# Altium schematic sheet 0063_DG2 DISPLAY - HDMI.SchDoc
size 848 x 558 mm
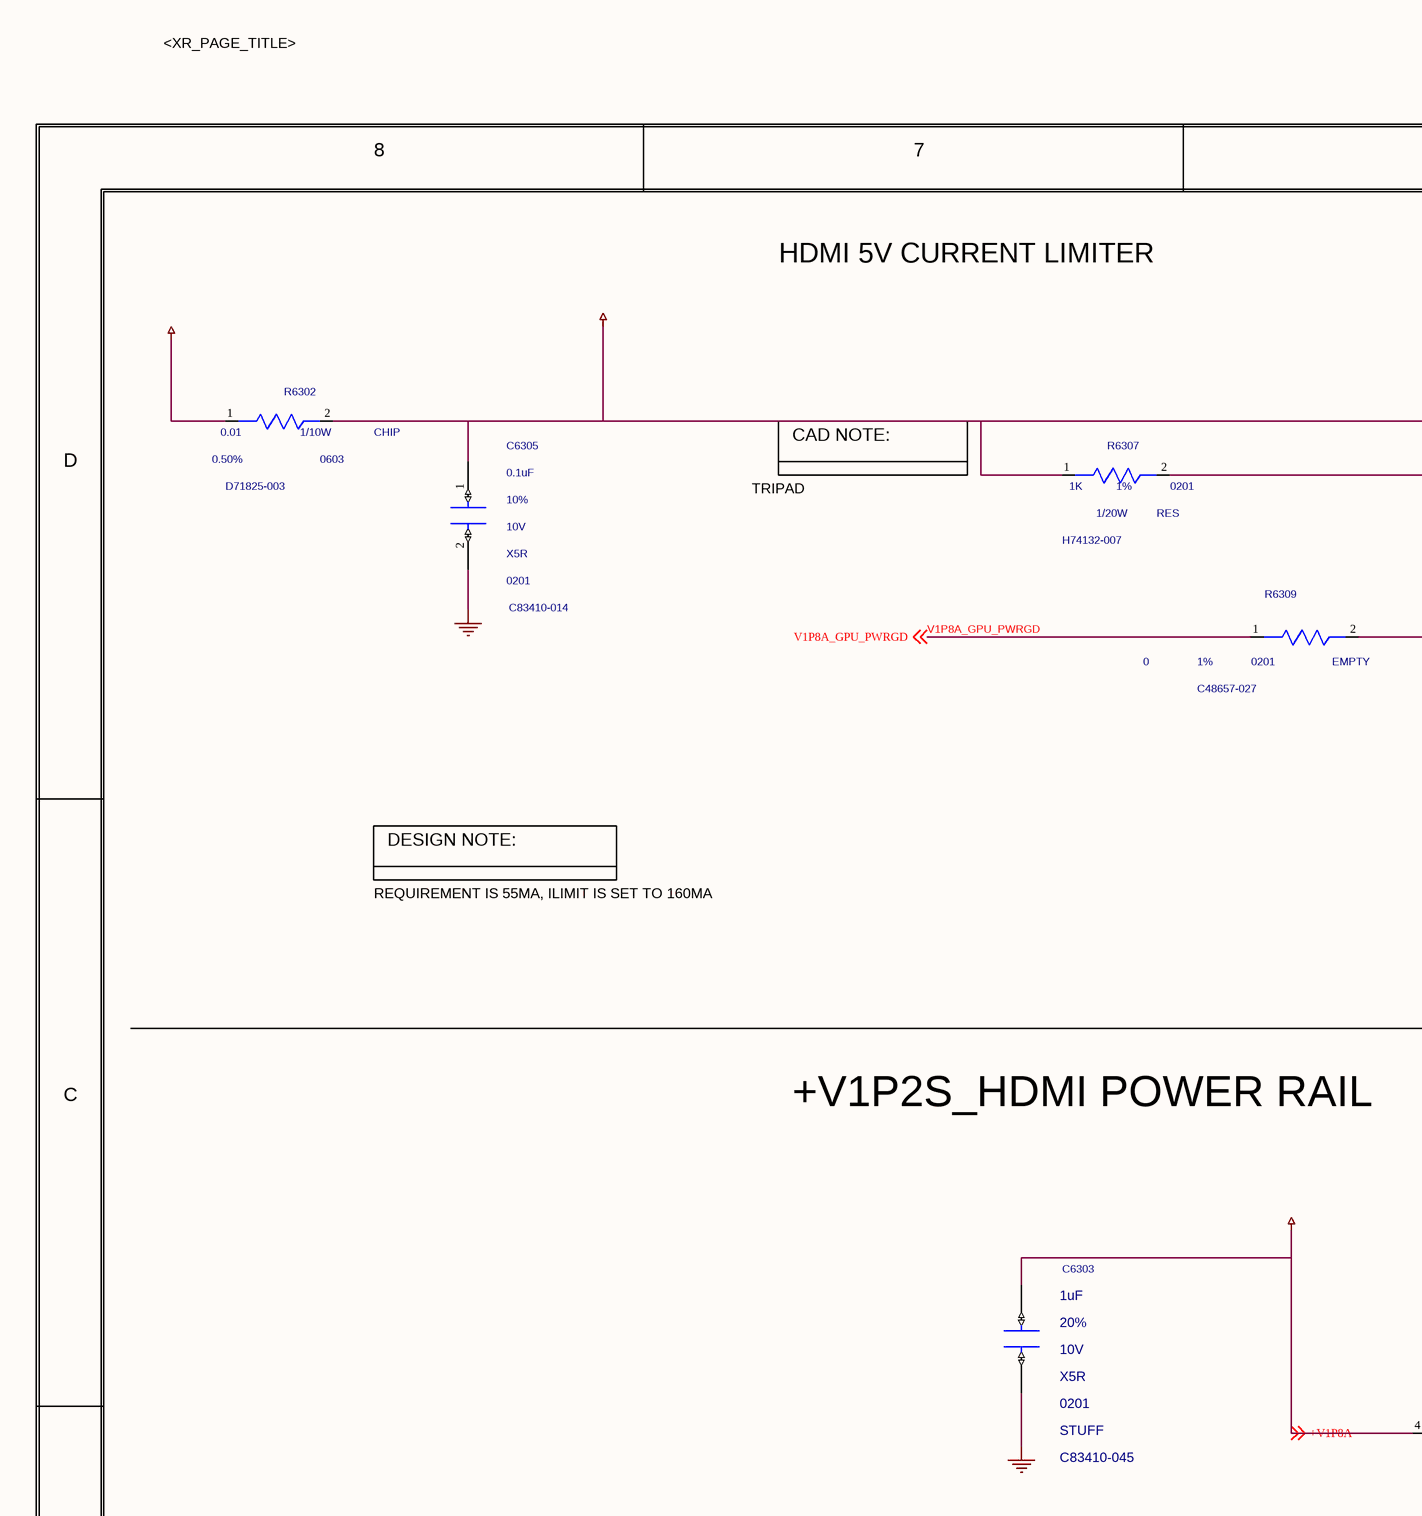
[diagram p0: 0063_DG2 DISPLAY - HDMI.SchDoc, top left]
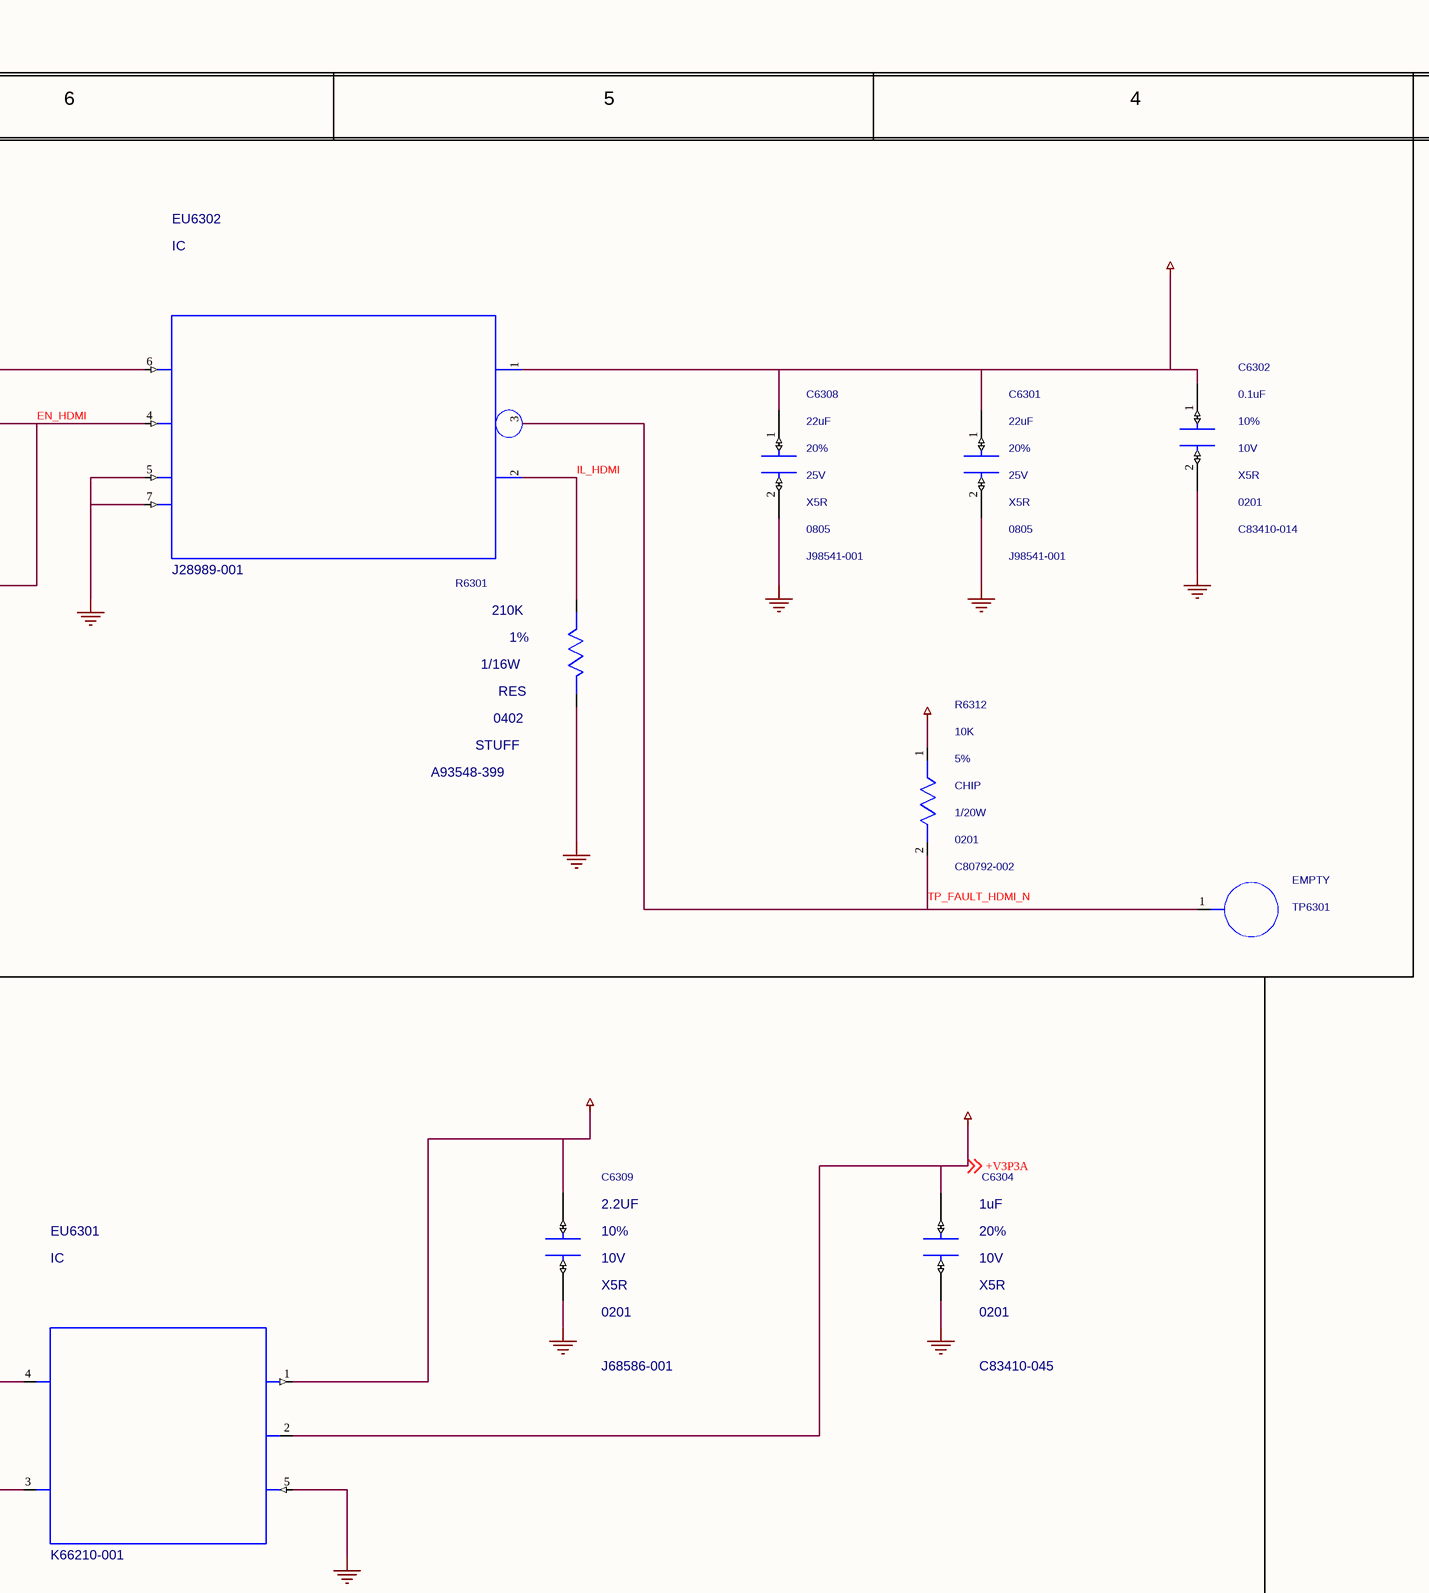
[diagram p1: 0063_DG2 DISPLAY - HDMI.SchDoc, top middle]
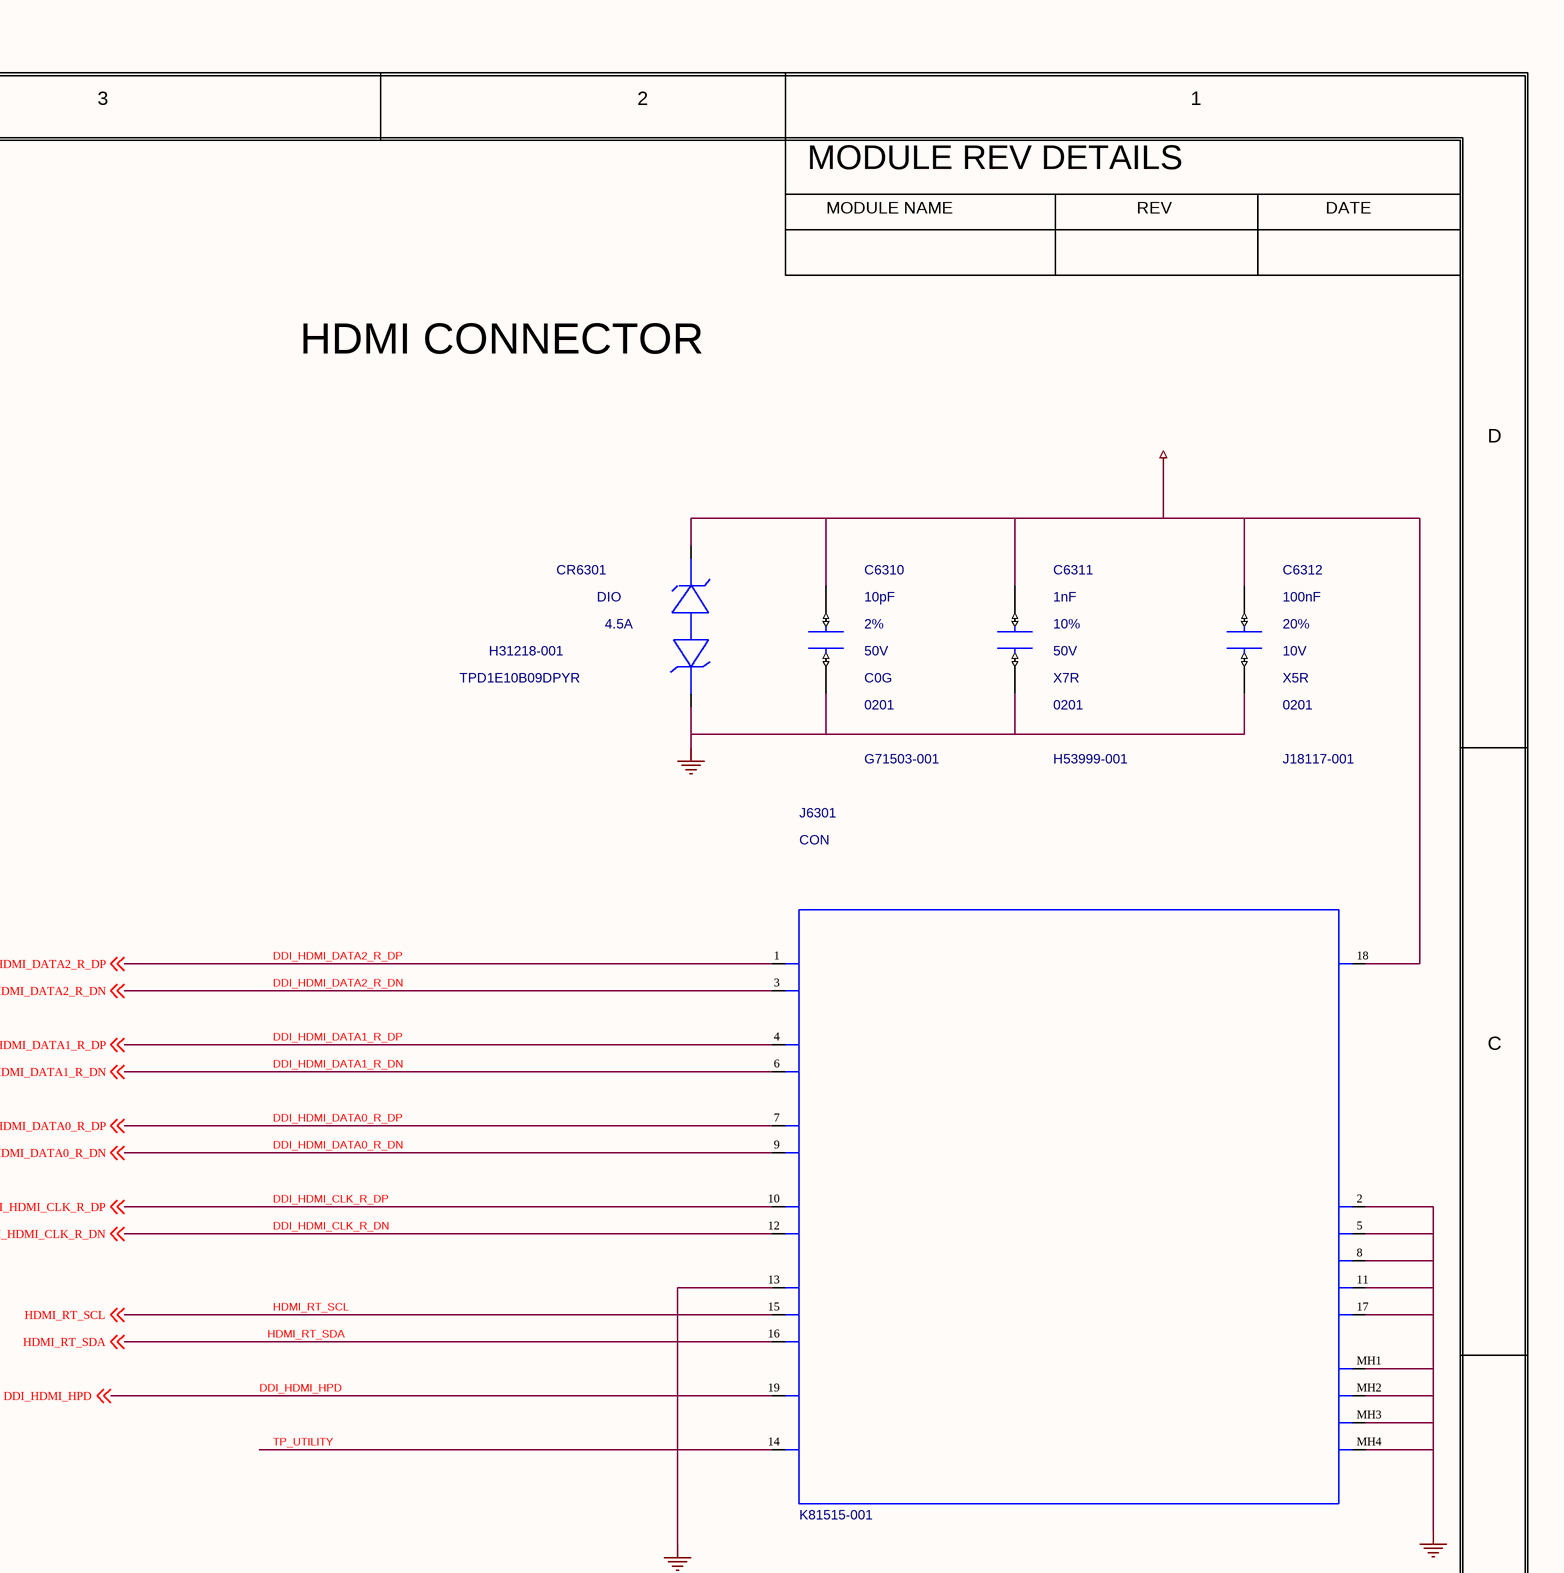
[diagram p2: 0063_DG2 DISPLAY - HDMI.SchDoc, top right]
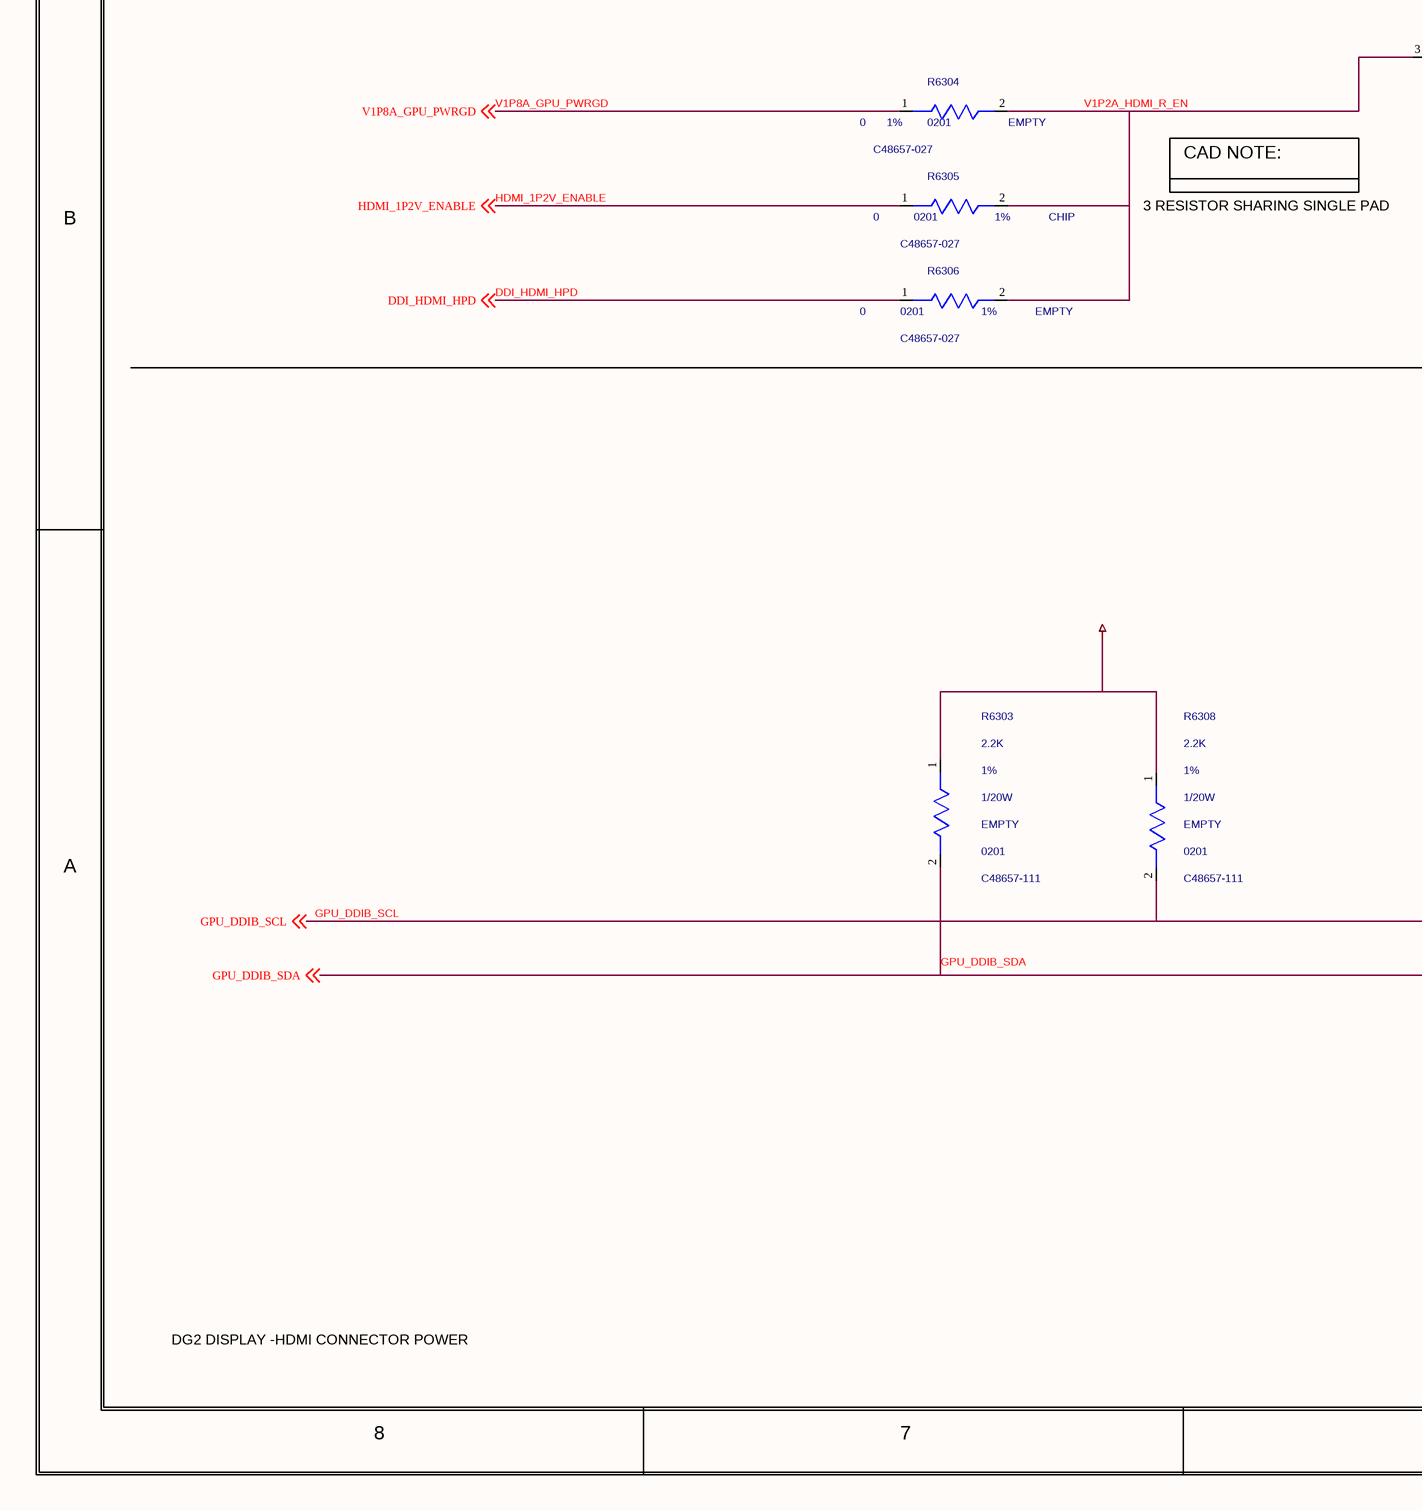
[diagram p3: 0063_DG2 DISPLAY - HDMI.SchDoc, bottom left]
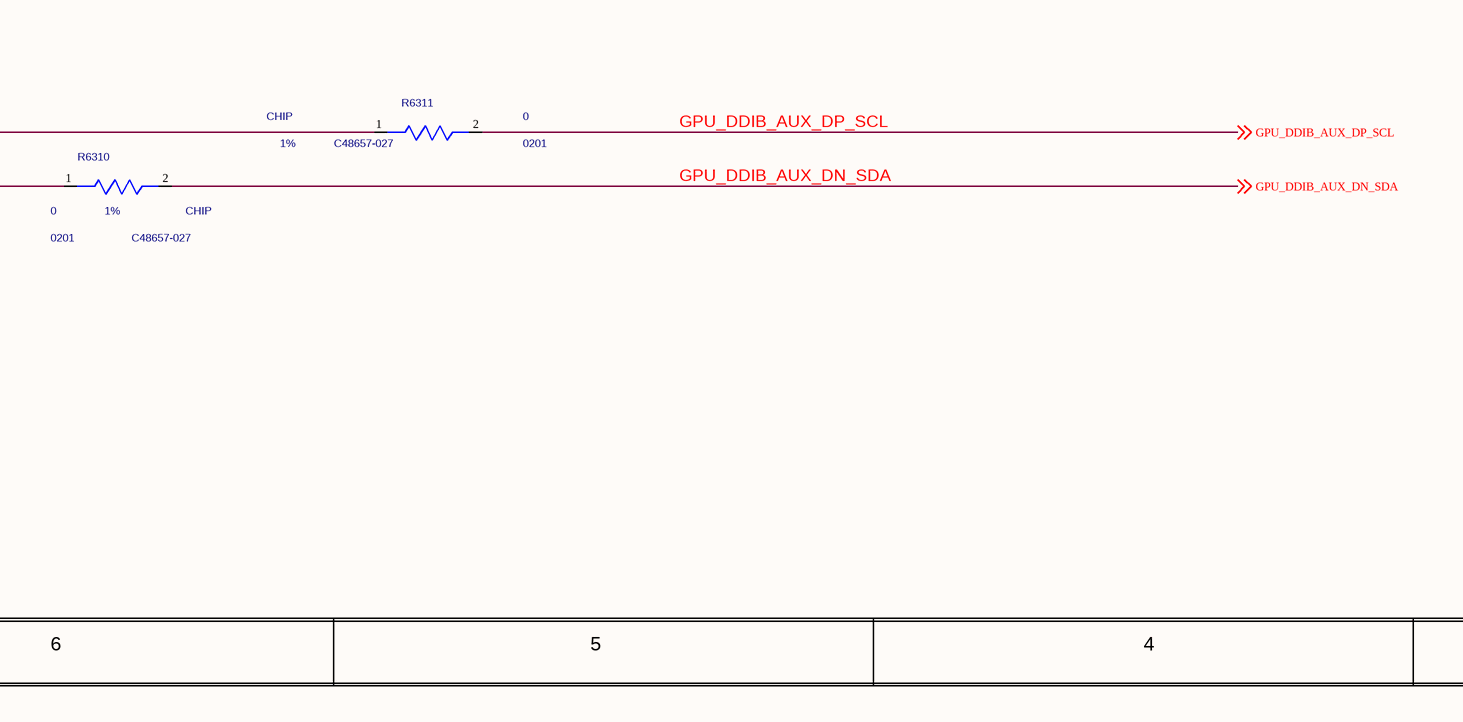
[diagram p4: 0063_DG2 DISPLAY - HDMI.SchDoc, bottom middle]
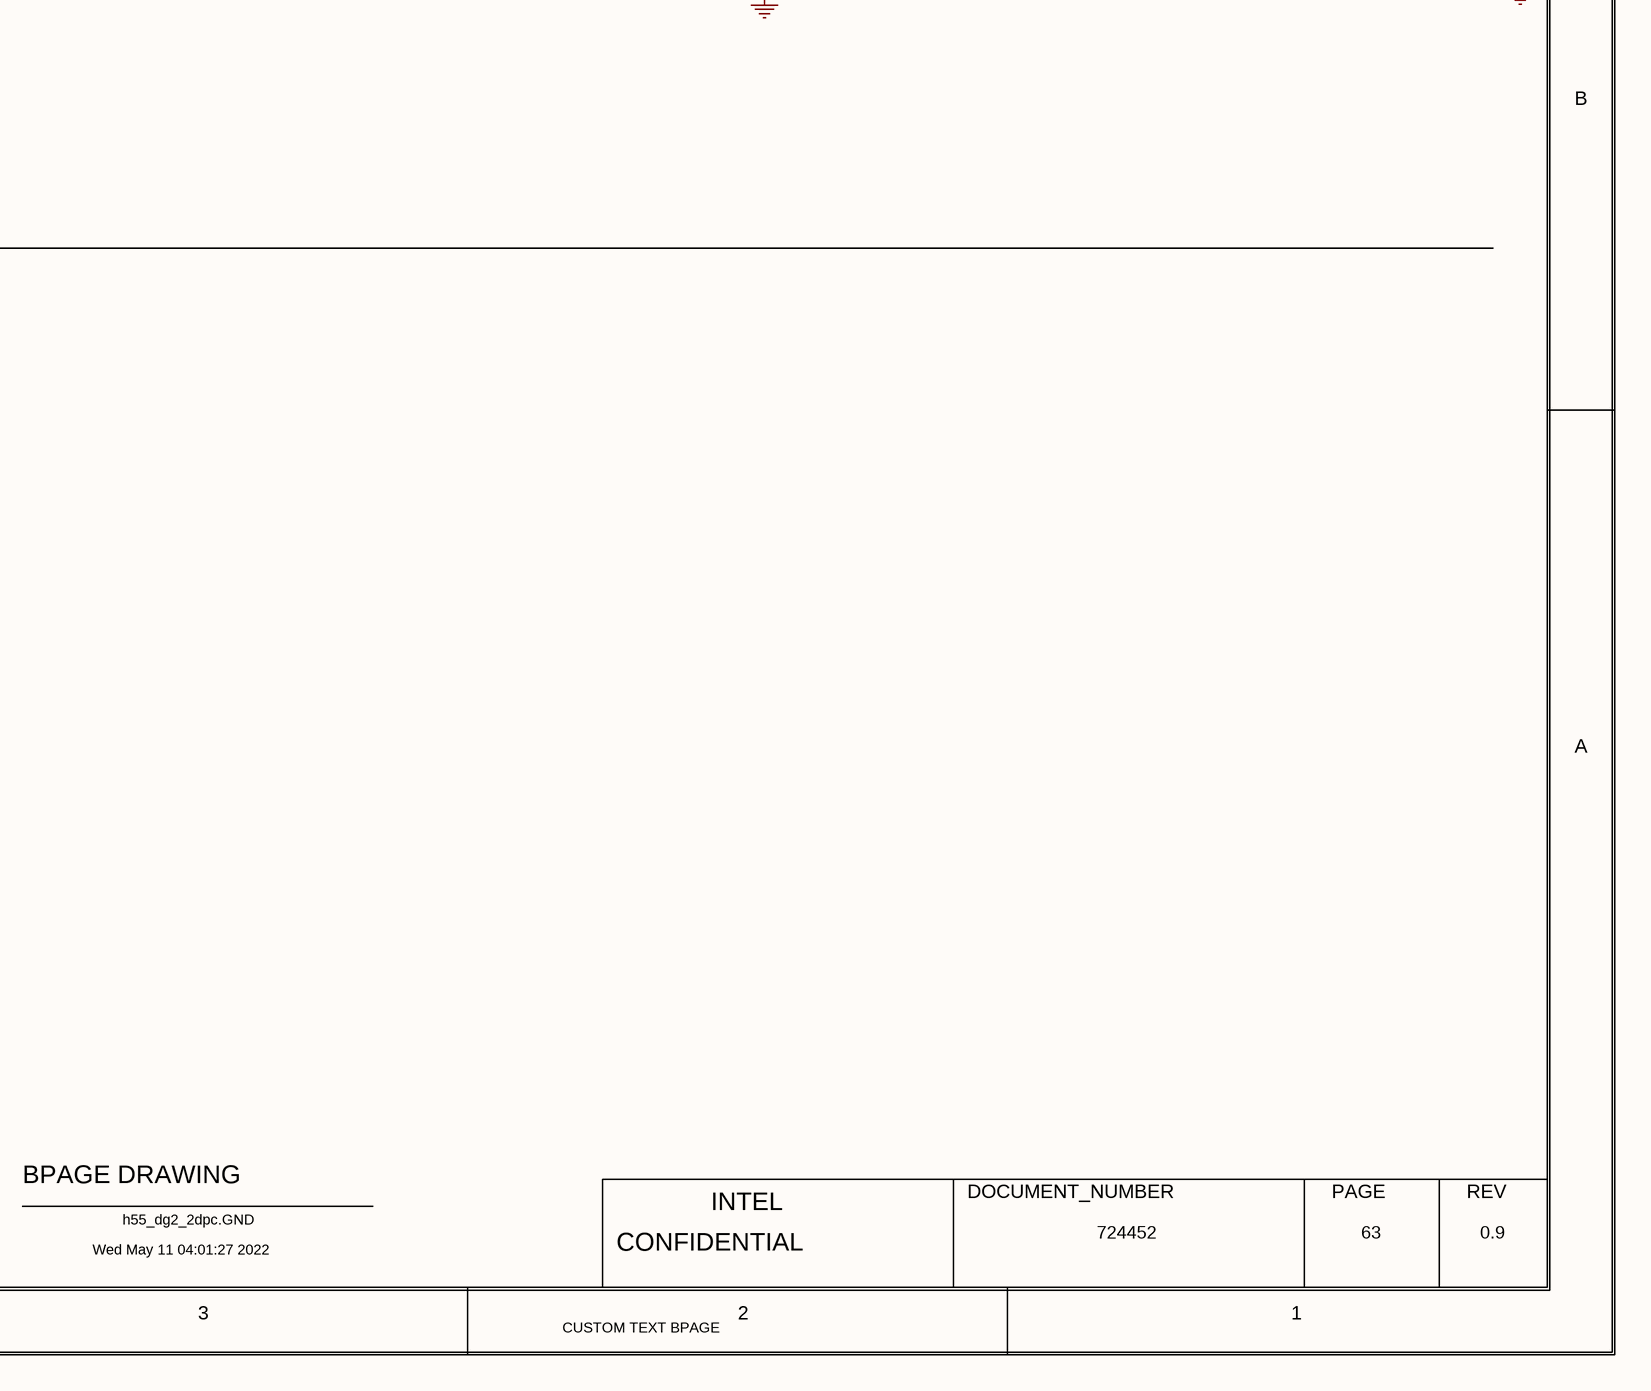
[diagram p5: 0063_DG2 DISPLAY - HDMI.SchDoc, bottom right]

## Parts
C6301  22uF  MATERIAL: X5R  PACK_TYPE: 0805  PART_NUMBER: J98541-001  TOLERANCE: 20%  VOLTAGE: 25V  [SMC0805MA]
C6302  0.1uF  MATERIAL: X5R  PACK_TYPE: 0201  PART_NUMBER: C83410-014  TOLERANCE: 10%  VOLTAGE: 10V  [SMC0201IA]
C6303  1uF  BOM_USE: STUFF  MATERIAL: X5R  PACK_TYPE: 0201  PART_NUMBER: C83410-045  TOLERANCE: 20%  VOLTAGE: 10V  [TK0_SM0201_690X390_MA]
C6304  1uF  MATERIAL: X5R  PACK_TYPE: 0201  PART_NUMBER: C83410-045  TOLERANCE: 20%  VOLTAGE: 10V  [TK0_SM0201_690X390_MA]
C6305  0.1uF  MATERIAL: X5R  PACK_TYPE: 0201  PART_NUMBER: C83410-014  TOLERANCE: 10%  VOLTAGE: 10V  [SMC0201IA]
C6308  22uF  MATERIAL: X5R  PACK_TYPE: 0805  PART_NUMBER: J98541-001  TOLERANCE: 20%  VOLTAGE: 25V  [SMC0805MA]
C6309  2.2UF  MATERIAL: X5R  PACK_TYPE: 0201  PART_NUMBER: J68586-001  TOLERANCE: 10%  VOLTAGE: 10V  [TK0_SM0201_690X390_MC]
C6310  10pF  MATERIAL: C0G  PACK_TYPE: 0201  PART_NUMBER: G71503-001  TOLERANCE: 2%  VOLTAGE: 50V  [CTK2_SM0201_630X330_MA]
C6311  1nF  MATERIAL: X7R  PACK_TYPE: 0201  PART_NUMBER: H53999-001  TOLERANCE: 10%  VOLTAGE: 50V  [CTK2_SM0201_630X330_MA]
C6312  100nF  MATERIAL: X5R  PACK_TYPE: 0201  PART_NUMBER: J18117-001  TOLERANCE: 20%  VOLTAGE: 10V  [CTK2_SM0201_630X330_MA]
CR6301  TPD1E10B09DPYR  CURRENT: 4.5A  MATERIAL: DIO  PART_NUMBER: H31218-001  [CTK0_SCR0402_1100X700_MA]
EU6301  MATERIAL: IC  PART_NUMBER: K66210-001  [CTK0_LCC4_S1250_800_DF971X891_MA_VR]  (hidden comment: C_WL2831)
EU6302  MATERIAL: IC  PART_NUMBER: J28989-001  [CTK2_LCC6_S2075_650_DF960X1650_MA]  (hidden comment: C_AP255X)
J6301  MATERIAL: CON  PART_NUMBER: K81515-001  [CHDMI_TYPE_A_MIDJR_19P_4EM_1000_MC_PIP_MR]  (hidden comment: C_HDMI_STD_TYPE_A_19P_4EM)
R6301  210K  BOM_USE: STUFF  MATERIAL: RES  PACK_TYPE: 0402  PART_NUMBER: A93548-399  TOLERANCE: 1%  WATTAGE: 1/16W  [TK0_SM0402_1100X550_MC]
R6302  0.01  MATERIAL: CHIP  PACK_TYPE: 0603  PART_NUMBER: D71825-003  TOLERANCE: 0.50%  WATTAGE: 1/10W  [SMR0603IB]
R6303  2.2K  MATERIAL: EMPTY  PACK_TYPE: 0201  PART_NUMBER: C48657-111  TOLERANCE: 1%  WATTAGE: 1/20W  [SMR0201IA]
R6304  0  MATERIAL: EMPTY  PACK_TYPE: 0201  PART_NUMBER: C48657-027  TOLERANCE: 1%  [SMR0201IA]
R6305  0  MATERIAL: CHIP  PACK_TYPE: 0201  PART_NUMBER: C48657-027  TOLERANCE: 1%  [SMR0201IA]
R6306  0  MATERIAL: EMPTY  PACK_TYPE: 0201  PART_NUMBER: C48657-027  TOLERANCE: 1%  [SMR0201IA]
R6307  1K  MATERIAL: RES  PACK_TYPE: 0201  PART_NUMBER: H74132-007  TOLERANCE: 1%  WATTAGE: 1/20W  [SMR0201IA]
R6308  2.2K  MATERIAL: EMPTY  PACK_TYPE: 0201  PART_NUMBER: C48657-111  TOLERANCE: 1%  WATTAGE: 1/20W  [SMR0201IA]
R6309  0  MATERIAL: EMPTY  PACK_TYPE: 0201  PART_NUMBER: C48657-027  TOLERANCE: 1%  [SMR0201IA]
R6310  0  MATERIAL: CHIP  PACK_TYPE: 0201  PART_NUMBER: C48657-027  TOLERANCE: 1%  [SMR0201IA]
R6311  0  MATERIAL: CHIP  PACK_TYPE: 0201  PART_NUMBER: C48657-027  TOLERANCE: 1%  [SMR0201IA]
R6312  10K  MATERIAL: CHIP  PACK_TYPE: 0201  PART_NUMBER: C80792-002  TOLERANCE: 5%  WATTAGE: 1/20W  [SMR0201IA]
TP6301  MATERIAL: EMPTY  [TP_C25]  (hidden comment: TP)

## Nets
+V1P2S_HDMI_RTR: C6309.1(A) EU6301.1(VOUT)
+V1P8A: C6303.1(A) EU6301.4(VIN) ; off-sheet +V1P8A
+V3P3A: C6304.1(A) EU6301.2(BIAS) ; off-sheet +V3P3A
+V3P3A_HDMI_RTR: R6303.1(A) R6308.1(A)
+V5A_HDMI: C6305.1(A) EU6302.6(IN) R6302.2(B) R6307.1(A) R6312.1(A)
+V5A_HDMI_DDIB: C6301.1(A) C6302.1(A) C6308.1(A) C6310.1(A) C6311.1(A) C6312.1(A) CR6301.2(K2) EU6302.1(OUT) J6301.18(5V_P)
+V5A_L: R6302.1(A)
GND: C6301.2(B) C6302.2(B) C6303.2(B) C6304.2(B) C6305.2(B) C6308.2(B) C6309.2(B) C6310.2(B) C6311.2(B) C6312.2(B) CR6301.1(K1) EU6301.5(GND_TPD) EU6302.5(GND) EU6302.7(GND_TPD) J6301.2(TMDS_DATA2_SHIELD) J6301.5(TMDS_DATA1_SHIELD) J6301.8(TMDS_DATA0_SHIELD) J6301.11(TMDS_CLK_SHIELD) J6301.13(CEC) J6301.17(DDC_HEC_CEC_GND) J6301.MH1 J6301.MH2 J6301.MH3 J6301.MH4 R6301.2(B)
DDI_HDMI_CLK_R_DN: J6301.12(TMDS_CLK_DN) ; off-sheet DDI_HDMI_CLK_R_DN
DDI_HDMI_CLK_R_DP: J6301.10(TMDS_CLK_DP) ; off-sheet DDI_HDMI_CLK_R_DP
DDI_HDMI_DATA0_R_DN: J6301.9(TMDS_DATA0_DN) ; off-sheet DDI_HDMI_DATA0_R_DN
DDI_HDMI_DATA0_R_DP: J6301.7(TMDS_DATA0_DP) ; off-sheet DDI_HDMI_DATA0_R_DP
DDI_HDMI_DATA1_R_DN: J6301.6(TMDS_DATA1_DN) ; off-sheet DDI_HDMI_DATA1_R_DN
DDI_HDMI_DATA1_R_DP: J6301.4(TMDS_DATA1_DP) ; off-sheet DDI_HDMI_DATA1_R_DP
DDI_HDMI_DATA2_R_DN: J6301.3(TMDS_DATA2_DN) ; off-sheet DDI_HDMI_DATA2_R_DN
DDI_HDMI_DATA2_R_DP: J6301.1(TMDS_DATA2_DP) ; off-sheet DDI_HDMI_DATA2_R_DP
DDI_HDMI_HPD: J6301.19(HOT_PLUG_DETECT_HEC_DATA_M) R6306.1(A) ; off-sheet DDI_HDMI_HPD
EN_HDMI: EU6302.4(EN_N_EN) R6307.2(B) R6309.2(B)
GPU_DDIB_AUX_DN_SDA: R6310.2(B) ; off-sheet GPU_DDIB_AUX_DN_SDA
GPU_DDIB_AUX_DP_SCL: R6311.2(B) ; off-sheet GPU_DDIB_AUX_DP_SCL
GPU_DDIB_SCL: R6308.2(B) R6311.1(A) ; off-sheet GPU_DDIB_SCL
GPU_DDIB_SDA: R6303.2(B) R6310.1(A) ; off-sheet GPU_DDIB_SDA
HDMI_1P2V_ENABLE: R6305.1(A) ; off-sheet HDMI_1P2V_ENABLE
HDMI_RT_SCL: J6301.15(SCL) ; off-sheet HDMI_RT_SCL
HDMI_RT_SDA: J6301.16(SDA) ; off-sheet HDMI_RT_SDA
IL_HDMI: EU6302.2(ILIM) R6301.1(A)
TP_FAULT_HDMI_N: EU6302.3(FAULT_N) R6312.2(B) TP6301.1(TP)
TP_UTILITY: J6301.14(RESERVED_UTILITY_HEAC_P)
V1P2A_HDMI_R_EN: EU6301.3(EN) R6304.2(B) R6305.2(B) R6306.2(B)
V1P8A_GPU_PWRGD: R6304.1(A) R6309.1(A) ; off-sheet V1P8A_GPU_PWRGD

## Notes on the sheet
- <XR_PAGE_TITLE>
- 8
- 7
- 6
- 5
- 4
- 3
- 2
- 1
- MODULE REV DETAILS
- HDMI 5V CURRENT LIMITER
- MODULE NAME
- REV
- DATE
- CAD NOTE:
- HDMI CONNECTOR
- D
- TRIPAD
- DESIGN NOTE:
- REQUIREMENT IS 55MA, ILIMIT IS SET TO 160MA
- C
- +V1P2S_HDMI POWER RAIL
- B
- 3 RESISTOR SHARING SINGLE PAD
- A
- BPAGE DRAWING
- INTEL
- DOCUMENT_NUMBER
- PAGE
- DG2 DISPLAY -HDMI CONNECTOR POWER
- Wed May 11 04:01:27 2022
- h55_dg2_2dpc.GND
- CONFIDENTIAL
- 724452
- 63
- 0.9
- CUSTOM TEXT BPAGE

## Library data of the parts
C6301 = CAP: CDS_PHYS_PART_NAME: CAP_0805-J98541-001,X5R,22UF,25V,20%,LPDB,GENERIC; OriginalSymbolOrigin: (-50,25); XY: (400,4150); VER: 1; ROT: 0; PHYS_PAGE: 63; LOCATION: C6301; DRAWING: @RVP1_ADL_SB_ADP_S_DDR5_SODIMM_2DPC_LIB.H55_DG2_2DPC(SCH_1):PAGE63; CDS_LIB: discrete; PCB Footprint: SMC0805MA; SEC_TYPE: 0805; CHIPS_PART_NAME: CAP; CDS_PART_NAME: CAP_0805-J98541-001,X5R,22UF,25V,20%,LPDB,GENERIC; CDS_LOCATION: C6301
C6302 = CAP: CDS_PHYS_PART_NAME: CAP_0201-C83410-014,X5R,0.1UF,10V,10%,LPDB,GENERIC; OriginalSymbolOrigin: (-50,25); XY: (800,4200); VER: 1; SUITE: ADL; SUB_ROOM: HDMI_MISC; ROT: 0; ROOM1: HDMI; PHYS_PAGE: 63; LOCATION: C6302; DRAWING: @RVP1_ADL_SB_ADP_S_DDR5_SODIMM_2DPC_LIB.H55_DG2_2DPC(SCH_1):PAGE63; CONFIG: GENERAL; CDS_LIB: discrete; PCB Footprint: SMC0201IA; SEC_TYPE: 0201; CHIPS_PART_NAME: CAP; CDS_PART_NAME: CAP_0201-C83410-014,X5R,0.1UF,10V,10%,LPDB,GENERIC; CDS_LOCATION: C6302
C6303 = CAP_2: CDS_PHYS_PART_NAME: CAP_2_0201-C83410-045,X5R,1UF,10V,20%,TK0,GENERIC; CDS_LMAN_SYM_OUTLINE: -50,50,50,-50; FP_TECH: TK0; IP: GENERIC; ROOM: NONE; OriginalSymbolOrigin: (-50,25); XY: (-2100,2625); VER: 1; SUITE: ADL; SUB_ROOM: HDMI_MISC; ROT: 0; ROOM1: HDMI; PHYS_PAGE: 63; LOCATION: C6303; DRAWING: @RVP1_ADL_SB_ADP_S_DDR5_SODIMM_2DPC_LIB.H55_DG2_2DPC(SCH_1):PAGE63; CONFIG: GENERAL; CDS_LIB: discrete_2; VARIANT: ?; PCB Footprint: TK0_SM0201_690X390_MA; CHIPS_PART_NAME: CAP_2; CDS_PART_NAME: CAP_2_0201-C83410-045,X5R,1UF,10V,20%,TK0,GENERIC; CDS_LOCATION: C6303
C6304 = CAP_2: CDS_PHYS_PART_NAME: CAP_2_0201-C83410-045,X5R,1UF,10V,20%,TK0,GENERIC; BOM_USE: STUFF; CDS_LMAN_SYM_OUTLINE: -50,50,50,-50; FP_TECH: TK0; IP: GENERIC; ROOM: NONE; OriginalSymbolOrigin: (-50,25); XY: (325,2700); VER: 1; SUITE: ADL; SUB_ROOM: HDMI_MISC; ROT: 0; ROOM1: HDMI; PHYS_PAGE: 63; LOCATION: C6304; DRAWING: @RVP1_ADL_SB_ADP_S_DDR5_SODIMM_2DPC_LIB.H55_DG2_2DPC(SCH_1):PAGE63; CONFIG: GENERAL; CDS_LIB: discrete_2; VARIANT: ?; PCB Footprint: TK0_SM0201_690X390_MA; CHIPS_PART_NAME: CAP_2; CDS_PART_NAME: CAP_2_0201-C83410-045,X5R,1UF,10V,20%,TK0,GENERIC; CDS_LOCATION: C6304
C6305 = CAP: CDS_PHYS_PART_NAME: CAP_0201-C83410-014,X5R,0.1UF,10V,10%,LPDB,GENERIC; OriginalSymbolOrigin: (-50,25); XY: (-3125,4150); VER: 1; SUITE: ADL; SUB_ROOM: HDMI_MISC; ROT: 0; ROOM1: HDMI; PHYS_PAGE: 63; LOCATION: C6305; DRAWING: @RVP1_ADL_SB_ADP_S_DDR5_SODIMM_2DPC_LIB.H55_DG2_2DPC(SCH_1):PAGE63; CONFIG: GENERAL; CDS_LIB: discrete; PCB Footprint: SMC0201IA; CHIPS_PART_NAME: CAP; CDS_PART_NAME: CAP_0201-C83410-014,X5R,0.1UF,10V,10%,LPDB,GENERIC; CDS_LOCATION: C6305
C6308 = CAP: CDS_PHYS_PART_NAME: CAP_0805-J98541-001,X5R,22UF,25V,20%,LPDB,GENERIC; OriginalSymbolOrigin: (-50,25); XY: (25,4150); VER: 1; ROT: 0; PHYS_PAGE: 63; LOCATION: C6308; DRAWING: @RVP1_ADL_SB_ADP_S_DDR5_SODIMM_2DPC_LIB.H55_DG2_2DPC(SCH_1):PAGE63; CDS_LIB: discrete; PCB Footprint: SMC0805MA; CHIPS_PART_NAME: CAP; CDS_PART_NAME: CAP_0805-J98541-001,X5R,22UF,25V,20%,LPDB,GENERIC; CDS_LOCATION: C6308
C6309 = CAP_2: CDS_PHYS_PART_NAME: CAP_2_0201-J68586-001,X5R,2.2UF,10V,10%,TK0,GENERIC; BOM_USE: STUFF; CDS_LMAN_SYM_OUTLINE: -50,50,50,-50; FP_TECH: TK0; IP: GENERIC; ROOM: NONE; OriginalSymbolOrigin: (-50,25); XY: (-375,2700); VER: 1; SUITE: ADL; SUB_ROOM: HDMI_MISC; ROT: 0; ROOM1: HDMI; PHYS_PAGE: 63; LOCATION: C6309; DRAWING: @RVP1_ADL_SB_ADP_S_DDR5_SODIMM_2DPC_LIB.H55_DG2_2DPC(SCH_1):PAGE63; CONFIG: GENERAL; CDS_LIB: discrete_2; VARIANT: ?; PCB Footprint: TK0_SM0201_690X390_MC; CHIPS_PART_NAME: CAP_2; CDS_PART_NAME: CAP_2_0201-J68586-001,X5R,2.2UF,10V,10%,TK0,GENERIC; CDS_LOCATION: C6309
C6310 = C_CAP: CDS_PHYS_PART_NAME: C_CAP_0201-G71503-001,C0G,10PF,50V,2%,TK2,GENERIC; CDS_LMAN_SYM_OUTLINE: -50,50,50,-50; FP_TECH: TK2; IP: GENERIC; ROOM: NONE; OriginalSymbolOrigin: (-50,25); XY: (3025,3825); VER: 1; ROT: 0; PHYS_PAGE: 63; LOCATION: C6310; DRAWING: @RVP1_ADL_SB_ADP_S_DDR5_SODIMM_2DPC_LIB.H55_DG2_2DPC(SCH_1):PAGE63; CDS_LIB: c_discrete; VARIANT: ?; PCB Footprint: CTK2_SM0201_630X330_MA; CHIPS_PART_NAME: C_CAP; CDS_PART_NAME: C_CAP_0201-G71503-001,C0G,10PF,50V,2%,TK2,GENERIC; CDS_LOCATION: C6310
C6311 = C_CAP: CDS_PHYS_PART_NAME: C_CAP_0201-H53999-001,X7R,1NF,50V,10%,TK2,GENERIC; CDS_LMAN_SYM_OUTLINE: -50,50,50,-50; FP_TECH: TK2; IP: GENERIC; ROOM: NONE; OriginalSymbolOrigin: (-50,25); XY: (3375,3825); VER: 1; ROT: 0; PHYS_PAGE: 63; LOCATION: C6311; DRAWING: @RVP1_ADL_SB_ADP_S_DDR5_SODIMM_2DPC_LIB.H55_DG2_2DPC(SCH_1):PAGE63; CDS_LIB: c_discrete; VARIANT: ?; PCB Footprint: CTK2_SM0201_630X330_MA; CHIPS_PART_NAME: C_CAP; CDS_PART_NAME: C_CAP_0201-H53999-001,X7R,1NF,50V,10%,TK2,GENERIC; CDS_LOCATION: C6311
C6312 = C_CAP: CDS_PHYS_PART_NAME: C_CAP_0201-J18117-001,X5R,100NF,10V,20%,TK2,GENERIC; CDS_LMAN_SYM_OUTLINE: -50,50,50,-50; FP_TECH: TK2; IP: GENERIC; ROOM: NONE; OriginalSymbolOrigin: (-50,25); XY: (3800,3825); VER: 1; ROT: 0; PHYS_PAGE: 63; LOCATION: C6312; DRAWING: @RVP1_ADL_SB_ADP_S_DDR5_SODIMM_2DPC_LIB.H55_DG2_2DPC(SCH_1):PAGE63; CDS_LIB: c_discrete; VARIANT: ?; PCB Footprint: CTK2_SM0201_630X330_MA; CHIPS_PART_NAME: C_CAP; CDS_PART_NAME: C_CAP_0201-J18117-001,X5R,100NF,10V,20%,TK2,GENERIC; CDS_LOCATION: C6312
CR6301 = C_DIODE_ESD_BIDIR_A: CDS_PHYS_PART_NAME: C_DIODE_ESD_BIDIR_A_SM-H31218-001,DIO,TPD1E10B09DPYR,4.5A,TK0,GA; CDS_LMAN_SYM_OUTLINE: -100,50,100,-50; FP_TECH: TK0; IP: GENERIC; PACK_TYPE: SM; ROOM: NONE; OriginalSymbolOrigin: (-125,50); XY: (2775,3850); VER: 1; PHYS_PAGE: 63; LOCATION: CR6301; DRAWING: @RVP1_ADL_SB_ADP_S_DDR5_SODIMM_2DPC_LIB.H55_DG2_2DPC(SCH_1):PAGE63; CDS_LIB: local; VARIANT: ?; PCB Footprint: CTK0_SCR0402_1100X700_MA; ROT: 1; CHIPS_PART_NAME: C_DIODE_ESD_BIDIR_A; CDS_PART_NAME: C_DIODE_ESD_BIDIR_A_SM-H31218-001,DIO,TPD1E10B09DPYR,4.5A,TK0,GA; CDS_LOCATION: CR6301
EU6301 = C_WL2831: CDS_PHYS_PART_NAME: C_WL2831_LCC-K66210-001,IC,WL2831D12-4/TR,TK0,GENERIC; CDS_LMAN_SYM_OUTLINE: -200,200,200,-200; FP_TECH: TK0; IP: GENERIC; PACK_TYPE: LCC; ROOM: NONE; OriginalSymbolOrigin: (-225,200); XY: (-1125,2350); VER: 1; ROT: 0; PHYS_PAGE: 63; LOCATION: EU6301; DRAWING: @RVP1_ADL_SB_ADP_S_DDR5_SODIMM_2DPC_LIB.H55_DG2_2DPC(SCH_1):PAGE63; CDS_LIB: local; VARIANT: ?; PCB Footprint: CTK0_LCC4_S1250_800_DF971X891_MA_VR; SEC_TYPE: LCC; CHIPS_PART_NAME: C_WL2831; CDS_PART_NAME: C_WL2831_LCC-K66210-001,IC,WL2831D12-4/TR,TK0,GENERIC; CDS_LOCATION: EU6301
EU6302 = C_AP255X: CDS_PHYS_PART_NAME: C_AP255X_LCC-J28989-001,IC,AP2553AFDC-7,TK2,GENERIC; CDS_LMAN_SYM_OUTLINE: -300,250,300,-200; FP_TECH: TK2; IP: GENERIC; PACK_TYPE: LCC; ROOM: NONE; OriginalSymbolOrigin: (-325,250); XY: (-800,4175); VER: 1; ROT: 0; PHYS_PAGE: 63; LOCATION: EU6302; DRAWING: @RVP1_ADL_SB_ADP_S_DDR5_SODIMM_2DPC_LIB.H55_DG2_2DPC(SCH_1):PAGE63; CDS_LIB: local; VARIANT: ?; PCB Footprint: CTK2_LCC6_S2075_650_DF960X1650_MA; SEC_TYPE: LCC; CHIPS_PART_NAME: C_AP255X; CDS_PART_NAME: C_AP255X_LCC-J28989-001,IC,AP2553AFDC-7,TK2,GENERIC; CDS_LOCATION: EU6302
J6301 = C_HDMI_STD_TYPE_A_19P_4EM: CDS_PHYS_PART_NAME: C_HDMI_STD_TYPE_A_19P_4EM_TH-K81515-001,CON,HDMI_STD_TYPE_A_19PA; CDS_LMAN_SYM_OUTLINE: -500,550,500,-550; FP_TECH: TK0; IP: GENERIC; PACK_TYPE: TH; ROOM: NONE; OriginalSymbolOrigin: (-525,550); XY: (3475,2775); VER: 1; ROT: 0; PHYS_PAGE: 63; LOCATION: J6301; DRAWING: @RVP1_ADL_SB_ADP_S_DDR5_SODIMM_2DPC_LIB.H55_DG2_2DPC(SCH_1):PAGE63; CDS_LIB: local; VARIANT: ?; PCB Footprint: CHDMI_TYPE_A_MIDJR_19P_4EM_1000_MC_PIP_MR; SEC_TYPE: TH; CHIPS_PART_NAME: C_HDMI_STD_TYPE_A_19P_4EM; CDS_PART_NAME: C_HDMI_STD_TYPE_A_19P_4EM_TH-K81515-001,CON,HDMI_STD_TYPE_A_19PA; CDS_LOCATION: J6301
R6301 = RES_2: CDS_PHYS_PART_NAME: RES_2_0402-A93548-399,RES,210K,1%,1/16W,TK0,GENERIC; CDS_LMAN_SYM_OUTLINE: -50,50,50,-50; FP_TECH: TK0; IP: GENERIC; ROOM: NONE; OriginalSymbolOrigin: (-25,75); XY: (-350,3800); VER: 2; PHYS_PAGE: 63; LOCATION: R6301; DRAWING: @RVP1_ADL_SB_ADP_S_DDR5_SODIMM_2DPC_LIB.H55_DG2_2DPC(SCH_1):PAGE63; CDS_LIB: discrete_2; VARIANT: ?; PCB Footprint: TK0_SM0402_1100X550_MC; SEC_TYPE: 0402; ROT: 2; CHIPS_PART_NAME: RES_2; CDS_PART_NAME: RES_2_0402-A93548-399,RES,210K,1%,1/16W,TK0,GENERIC; CDS_LOCATION: R6301
R6302 = RES#1: CHIPS_PART_NAME: RES; CDS_PHYS_PART_NAME: RES_0603-D71825-003,CHIP,0.01,0.50%,1/10W,LPDB,GENERIC; OriginalSymbolOrigin: (-75,25); XY: (-3475,4325); VER: 1; ROT: 0; PHYS_PAGE: 63; LOCATION: R6302; IP: GENERIC; FP_TECH: LPDB; DRAWING: @RVP1_ADL_SB_ADP_S_DDR5_SODIMM_2DPC_LIB.H55_DG2_2DPC(SCH_1):PAGE63; CDS_LIB: discrete; PCB Footprint: SMR0603IB; CDS_PART_NAME: RES_0603-D71825-003,CHIP,0.01,0.50%,1/10W,LPDB,GENERIC; CDS_LOCATION: R6302
R6303 = RES: CDS_PHYS_PART_NAME: RES_0201-C48657-111,EMPTY,2.2K,1%,1/20W,LPDB,GENERIC; OriginalSymbolOrigin: (-25,75); XY: (-2250,850); VER: 2; ROT: 0; PHYS_PAGE: 63; LOCATION: R6303; DRAWING: @RVP1_ADL_SB_ADP_S_DDR5_SODIMM_2DPC_LIB.H55_DG2_2DPC(SCH_1):PAGE63; CDS_LIB: discrete; PCB Footprint: SMR0201IA; CHIPS_PART_NAME: RES; CDS_PART_NAME: RES_0201-C48657-111,EMPTY,2.2K,1%,1/20W,LPDB,GENERIC; CDS_LOCATION: R6303
R6304 = RES#1: CHIPS_PART_NAME: RES; CDS_PHYS_PART_NAME: RES_0201-C48657-027,EMPTY,0,1%,1/20W,LPDB,GENERIC; WATTAGE: 1/20W; OriginalSymbolOrigin: (-75,25); XY: (-2225,2150); VER: 1; SUITE: ADL; SUB_ROOM: HDMI_MISC; ROOM1: HDMI; PHYS_PAGE: 63; LOCATION: R6304; IP: GENERIC; FP_TECH: LPDB; DRAWING: @RVP1_ADL_SB_ADP_S_DDR5_SODIMM_2DPC_LIB.H55_DG2_2DPC(SCH_1):PAGE63; CONFIG: GENERAL; CDS_LIB: discrete; PCB Footprint: SMR0201IA; ROT: 0; CDS_PART_NAME: RES_0201-C48657-027,EMPTY,0,1%,1/20W,LPDB,GENERIC; CDS_LOCATION: R6304
R6305 = RES#1: CHIPS_PART_NAME: RES; CDS_PHYS_PART_NAME: RES_0201-C48657-027,CHIP,0,1%,1/20W,LPDB,GENERIC; WATTAGE: 1/20W; OriginalSymbolOrigin: (-75,25); XY: (-2225,1975); VER: 1; SUITE: ADL; SUB_ROOM: HDMI_MISC; ROOM1: HDMI; PHYS_PAGE: 63; LOCATION: R6305; IP: GENERIC; FP_TECH: LPDB; DRAWING: @RVP1_ADL_SB_ADP_S_DDR5_SODIMM_2DPC_LIB.H55_DG2_2DPC(SCH_1):PAGE63; CONFIG: GENERAL; CDS_LIB: discrete; PCB Footprint: SMR0201IA; ROT: 0; CDS_PART_NAME: RES_0201-C48657-027,CHIP,0,1%,1/20W,LPDB,GENERIC; CDS_LOCATION: R6305
R6306 = RES#1: CHIPS_PART_NAME: RES; CDS_PHYS_PART_NAME: RES_0201-C48657-027,EMPTY,0,1%,1/20W,LPDB,GENERIC; WATTAGE: 1/20W; OriginalSymbolOrigin: (-75,25); XY: (-2225,1800); VER: 1; SUITE: ADL; SUB_ROOM: HDMI_MISC; ROOM1: HDMI; PHYS_PAGE: 63; LOCATION: R6306; IP: GENERIC; FP_TECH: LPDB; DRAWING: @RVP1_ADL_SB_ADP_S_DDR5_SODIMM_2DPC_LIB.H55_DG2_2DPC(SCH_1):PAGE63; CONFIG: GENERAL; CDS_LIB: discrete; PCB Footprint: SMR0201IA; ROT: 0; CDS_PART_NAME: RES_0201-C48657-027,EMPTY,0,1%,1/20W,LPDB,GENERIC; CDS_LOCATION: R6306
R6307 = RES#1: CDS_PHYS_PART_NAME: RES_0201-H74132-007,RES,1K,1%,1/20W,LPDB,GENERIC; OriginalSymbolOrigin: (-75,25); XY: (-1925,4225); VER: 1; ROT: 0; PHYS_PAGE: 63; LOCATION: R6307; IP: GENERIC; FP_TECH: LPDB; DRAWING: @RVP1_ADL_SB_ADP_S_DDR5_SODIMM_2DPC_LIB.H55_DG2_2DPC(SCH_1):PAGE63; CDS_LIB: discrete; PCB Footprint: SMR0201IA; CHIPS_PART_NAME: RES; CDS_PART_NAME: RES_0201-H74132-007,RES,1K,1%,1/20W,LPDB,GENERIC; CDS_LOCATION: R6307
R6308 = RES: CDS_PHYS_PART_NAME: RES_0201-C48657-111,EMPTY,2.2K,1%,1/20W,LPDB,GENERIC; OriginalSymbolOrigin: (-25,75); XY: (-1850,825); VER: 2; ROT: 0; PHYS_PAGE: 63; LOCATION: R6308; DRAWING: @RVP1_ADL_SB_ADP_S_DDR5_SODIMM_2DPC_LIB.H55_DG2_2DPC(SCH_1):PAGE63; CDS_LIB: discrete; PCB Footprint: SMR0201IA; CHIPS_PART_NAME: RES; CDS_PART_NAME: RES_0201-C48657-111,EMPTY,2.2K,1%,1/20W,LPDB,GENERIC; CDS_LOCATION: R6308
R6309 = RES#1: CHIPS_PART_NAME: RES; CDS_PHYS_PART_NAME: RES_0201-C48657-027,EMPTY,0,1%,1/20W,LPDB,GENERIC; WATTAGE: 1/20W; OriginalSymbolOrigin: (-75,25); XY: (-1575,3925); VER: 1; SUITE: ADL; SUB_ROOM: HDMI_MISC; ROOM1: HDMI; PHYS_PAGE: 63; LOCATION: R6309; IP: GENERIC; FP_TECH: LPDB; DRAWING: @RVP1_ADL_SB_ADP_S_DDR5_SODIMM_2DPC_LIB.H55_DG2_2DPC(SCH_1):PAGE63; CONFIG: GENERAL; CDS_LIB: discrete; PCB Footprint: SMR0201IA; ROT: 0; CDS_PART_NAME: RES_0201-C48657-027,EMPTY,0,1%,1/20W,LPDB,GENERIC; CDS_LOCATION: R6309
R6310 = RES#1: CHIPS_PART_NAME: RES; CDS_PHYS_PART_NAME: RES_0201-C48657-027,CHIP,0,1%,1/20W,LPDB,GENERIC; WATTAGE: 1/20W; OriginalSymbolOrigin: (-75,25); XY: (-1200,550); VER: 1; SUITE: ADL; SUB_ROOM: HDMI_MISC; ROOM1: HDMI; PHYS_PAGE: 63; LOCATION: R6310; IP: GENERIC; FP_TECH: LPDB; DRAWING: @RVP1_ADL_SB_ADP_S_DDR5_SODIMM_2DPC_LIB.H55_DG2_2DPC(SCH_1):PAGE63; CONFIG: GENERAL; CDS_LIB: discrete; PCB Footprint: SMR0201IA; ROT: 0; CDS_PART_NAME: RES_0201-C48657-027,CHIP,0,1%,1/20W,LPDB,GENERIC; CDS_LOCATION: R6310
R6311 = RES#1: CHIPS_PART_NAME: RES; CDS_PHYS_PART_NAME: RES_0201-C48657-027,CHIP,0,1%,1/20W,LPDB,GENERIC; WATTAGE: 1/20W; OriginalSymbolOrigin: (-75,25); XY: (-625,650); VER: 1; SUITE: ADL; SUB_ROOM: HDMI_MISC; ROOM1: HDMI; PHYS_PAGE: 63; LOCATION: R6311; IP: GENERIC; FP_TECH: LPDB; DRAWING: @RVP1_ADL_SB_ADP_S_DDR5_SODIMM_2DPC_LIB.H55_DG2_2DPC(SCH_1):PAGE63; CONFIG: GENERAL; CDS_LIB: discrete; PCB Footprint: SMR0201IA; ROT: 0; CDS_PART_NAME: RES_0201-C48657-027,CHIP,0,1%,1/20W,LPDB,GENERIC; CDS_LOCATION: R6311
R6312 = RES: CDS_PHYS_PART_NAME: RES_0201-C80792-002,CHIP,10K,5%,1/20W,LPDB,GENERIC; OriginalSymbolOrigin: (-25,75); XY: (300,3525); VER: 2; ROT: 0; PHYS_PAGE: 63; LOCATION: R6312; IP: GENERIC; FP_TECH: LPDB; DRAWING: @RVP1_ADL_SB_ADP_S_DDR5_SODIMM_2DPC_LIB.H55_DG2_2DPC(SCH_1):PAGE63; CDS_LIB: discrete; PCB Footprint: SMR0201IA; CHIPS_PART_NAME: RES; CDS_PART_NAME: RES_0201-C80792-002,CHIP,10K,5%,1/20W,LPDB,GENERIC; CDS_LOCATION: R6312
TP6301 = TP#2: PART_NUMBER: na_tpc25; CDS_PHYS_PART_NAME: TP_SM-NA_TPC25,EMPTY,TP_C25,LPDB,GENERIC; CDS_LMAN_SYM_OUTLINE: -150,100,100,-100; PACK_TYPE: SM; OriginalSymbolOrigin: (-75,50); XY: (900,3325); VER: 1; SUITE: ADL; SUB_ROOM: HDMI_MISC; ROT: 0; ROOM1: HDMI; PHYS_PAGE: 63; LOCATION: TP6301; IP: GENERIC; FP_TECH: LPDB; DRAWING: @RVP1_ADL_SB_ADP_S_DDR5_SODIMM_2DPC_LIB.H55_DG2_2DPC(SCH_1):PAGE63; CONFIG: GENERAL; CDS_LIB: board_artifacts; PCB Footprint: TP_C25; CHIPS_PART_NAME: TP; CDS_PART_NAME: TP_SM-NA_TPC25,EMPTY,TP_C25,LPDB,GENERIC; CDS_LOCATION: TP6301